# Altium schematic sheet BoostStage.SchDoc
size A
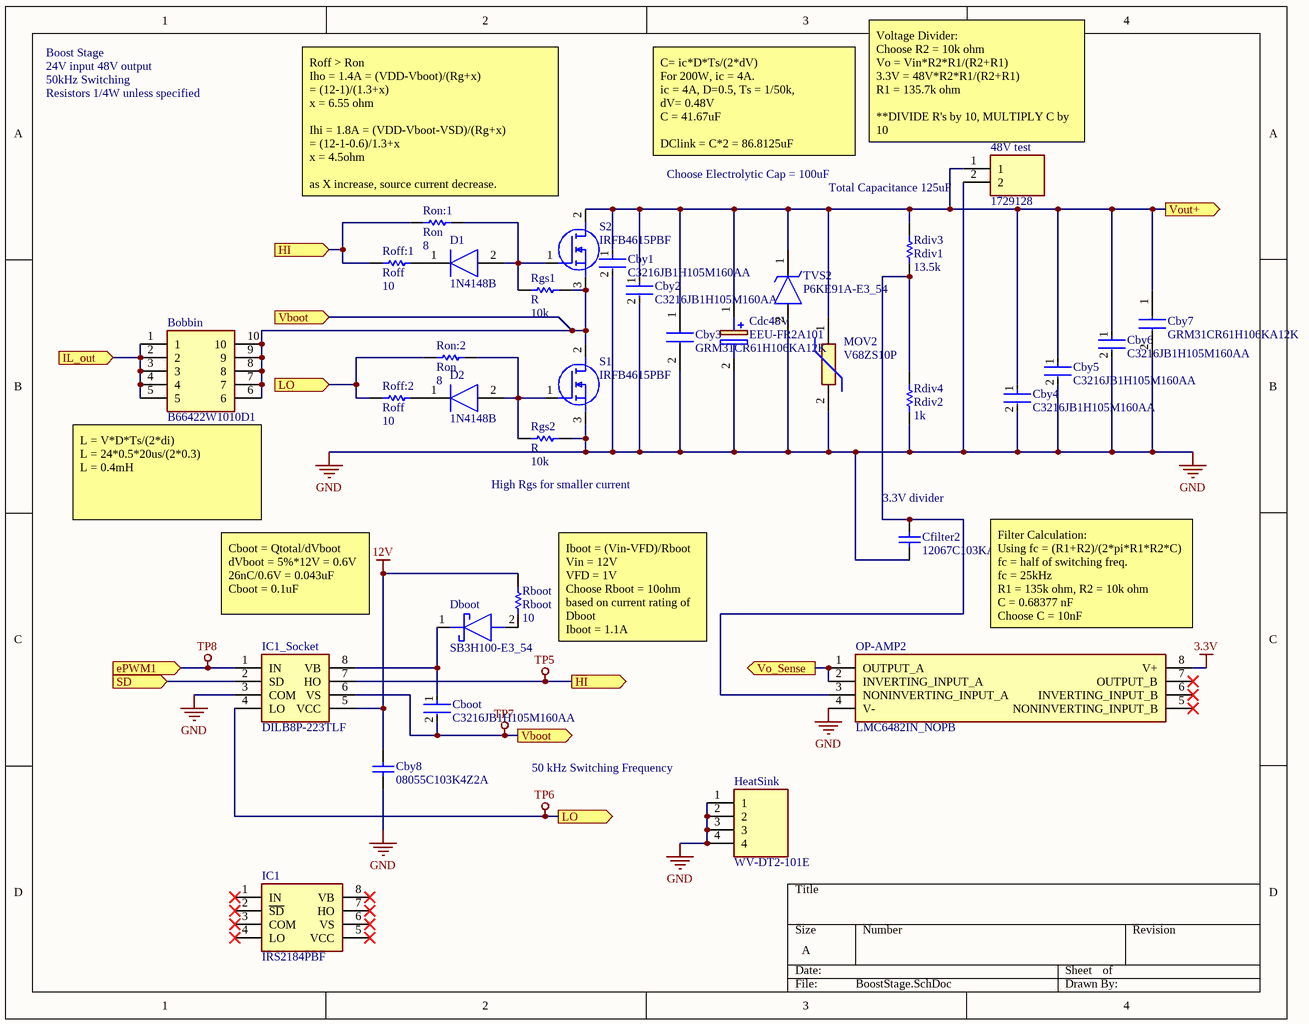
[diagram p0: BoostStage.SchDoc]

## Parts
48V_test  1729128  [HDRV2W110P0X508_1X2_1016X810X1000P]
Bobbin  B66422W1010D1  [B66422W1010D1]
Cboot  C3216JB1H105M160AA  [FP-C3216-160-0_2-IPC_B]
Cby1  C3216JB1H105M160AA  [FP-C3216-160-0_2-IPC_B]
Cby2  C3216JB1H105M160AA  [FP-C3216-160-0_2-IPC_B]
Cby3  GRM31CR61H106KA12K  [CAPC3216X180N]
Cby4  C3216JB1H105M160AA  [FP-C3216-160-0_2-IPC_B]
Cby5  C3216JB1H105M160AA  [FP-C3216-160-0_2-IPC_B]
Cby6  C3216JB1H105M160AA  [FP-C3216-160-0_2-IPC_B]
Cby7  GRM31CR61H106KA12K  [CAPC3216X180N]
Cby8  08055C103K4Z2A  [CAPC2013X94X50NL20T25]
Cdc48V  EEU-FR2A101  [CAPPRD500W65D1000H2200]
Cfilter2  12067C103KAT2A  [CAPC1206(3216)170_N]
D1  1N4148B  [DIOAD990W55L340D162]
D2  1N4148B  [DIOAD990W55L340D162]
Dboot  SB3H100-E3_54  [DIOAD2855W132L835D505]
HeatSink  WV-DT2-101E  [WVDT2101E]
IC1  IRS2184PBF  [DIP762W56P254L988H533Q8N]
IC1_Socket  DILB8P-223TLF  [DIPS762W60P254L1016H525Q8N]
MOV2  V68ZS10P  [V68ZS10P]
OP-AMP2  LMC6482IN_NOPB  [DIP794W53P254L959H508Q8N]
Rboot  Rboot  value 10  [AXIAL-0.3]
Rdiv3  Rdiv1  value 13.5k  [AXIAL-0.3]
Rdiv4  Rdiv2  value 1k  [AXIAL-0.3]
Rgs1  R  value 10k  [AXIAL-0.3]
Rgs2  R  value 10k  [AXIAL-0.3]
Roff:1  Roff  value 10  [AXIAL-0.3]
Roff:2  Roff  value 10  [AXIAL-0.3]
Ron:1  Ron  value 8  [AXIAL-0.3]
Ron:2  Ron  value 8  [AXIAL-0.3]
S1  IRFB4615PBF  [TO254P483X1016X1994-3P]
S2  IRFB4615PBF  [TO254P483X1016X1994-3P]
TVS2  P6KE91A-E3_54  [DIOAD1910W86L670D310]

## Ports
ePWM1 (in), HI (in), HI (out), IL_out (in), LO (in), LO (out), SD (in), Vboot (in), Vboot (out), Vo_Sense (out), Vout+ (out)

## Nets
3.3V: OP-AMP2.8(V+)
12V: Cby8.1 IC1_Socket.5(VCC) Rboot.2
GND: 48V_test.2 Cby1.2 Cby2.2 Cby3.2 Cby4.2 Cby5.2 Cby6.2 Cby7.2 Cby8.2 Cdc48V.2(-) Cfilter2.1 HeatSink.1 HeatSink.2 HeatSink.3 HeatSink.4 IC1_Socket.3(COM) MOV2.2 OP-AMP2.4(V-) Rdiv4.1 Rgs2.2 S1.3(S) TVS2.2(A)
TP5: IC1_Socket.7(HO) Roff:1.1 Ron:1.1 ; port HI
TP6: IC1_Socket.4(LO) Roff:2.1 Ron:2.1 ; port LO
TP7: Bobbin.6 Bobbin.7 Bobbin.8 Bobbin.9 Bobbin.10 Cboot.2 IC1_Socket.6(VS) Rgs1.2 S1.2(D) S2.3(S) ; port Vboot
TP8: IC1_Socket.1(IN) ; port ePWM1
IL_out: Bobbin.1 Bobbin.2 Bobbin.3 Bobbin.4 Bobbin.5 ; port IL_out
SD: IC1_Socket.2(SD) ; port SD
Vo_Sense: OP-AMP2.1(OUTPUT_A) OP-AMP2.2(INVERTING_INPUT_A) ; port Vo_Sense
Vout+: 48V_test.1 Cby1.1 Cby2.1 Cby3.1 Cby4.1 Cby5.1 Cby6.1 Cby7.1 Cdc48V.1(+) MOV2.1 Rdiv3.2 S2.2(D) TVS2.1(K) ; port Vout+
NetCboot_1: Cboot.1 Dboot.1(K) IC1_Socket.8(VB)
NetCfilter2_2: Cfilter2.2 OP-AMP2.3(NONINVERTING_INPUT_A) Rdiv3.1 Rdiv4.2
NetD1_1: D1.1(K) Roff:1.2
NetD1_2: D1.2(A) Rgs1.1 Ron:1.2 S2.1(G)
NetD2_1: D2.1(K) Roff:2.2
NetD2_2: D2.2(A) Rgs2.1 Ron:2.2 S1.1(G)
NetDboot_2: Dboot.2(A) Rboot.1

Not connected (* = marked no-connect by the designer): IC1 1(IN)* 2(~{SD})* 3(COM)* 4(LO)* 5(VCC)* 6(VS)* 7(HO)* 8(VB)*; OP-AMP2 5(NONINVERTING_INPUT_B)* 6(INVERTING_INPUT_B)* 7(OUTPUT_B)*

## Notes on the sheet
- Boost Stage
- 24V input 48V output
- 50kHz Switching
- Resistors 1/4W unless specified
- C= ic*D*Ts/(2*dV)
  For 200W, ic = 4A.
  ic = 4A, D=0.5, Ts = 1/50k,
  dV= 0.48V
  C = 41.67uF
  DClink = C*2 = 86.8125uF
- (near 48V_test) Voltage Divider:
  Choose R2 = 10k ohm
  Vo = Vin*R2*R1/(R2+R1)
  3.3V = 48V*R2*R1/(R2+R1)
  R1 = 135.7k ohm
  **DIVIDE R's by 10, MULTIPLY C by 10
- Roff > Ron
  Iho = 1.4A = (VDD-Vboot)/(Rg+x)
  = (12-1)/(1.3+x)
  x = 6.55 ohm
  Ihi = 1.8A = (VDD-Vboot-VSD)/(Rg+x)
  = (12-1-0.6)/1.3+x
  x = 4.5ohm
  as X increase, source current decrease.
- Choose Electrolytic Cap = 100uF
- (near 48V_test) Total Capacitance 125uF
- (near Rgs2) High Rgs for smaller current
- (near Cfilter2) 3.3V divider
- (near Bobbin) L = V*D*Ts/(2*di)
  L = 24*0.5*20us/(2*0.3)
  L = 0.4mH
- Cboot = Qtotal/dVboot
  dVboot = 5%*12V = 0.6V
  26nC/0.6V = 0.043uF
  Cboot = 0.1uF
- Iboot = (Vin-VFD)/Rboot
  Vin = 12V
  VFD = 1V
  Choose Rboot = 10ohm
  based on current rating of Dboot
  Iboot = 1.1A
- (near OP-AMP2) Filter Calculation:
  Using fc = (R1+R2)/(2*pi*R1*R2*C)
  fc = half of switching freq.
  fc = 25kHz
  R1 = 135k ohm, R2 = 10k ohm
  C = 0.68377 nF
  Choose C = 10nF
- (near HeatSink) 50 kHz Switching Frequency

## Library data of the parts
48V_test = 1729128: Connector; Manufacturer_Name: Phoenix Contact; Datasheet Link: http://docs-emea.rs-online.com/webdocs/1380/0900766b81380189.pdf; Height: 10mm; Manufacturer_Part_Number: 1729128; Mouser Part Number: 651-1729128; Mouser Price/Stock: https://www.mouser.co.uk/ProductDetail/Phoenix-Contact/1729128?qs=GFUSqQMLmmnCBVBY3dts9w%3D%3D; Arrow Part Number: 1729128; Arrow Price/Stock: https://www.arrow.com/en/products/1729128/phoenix-contact
Bobbin = B66422W1010D1: Bobbin; Manufacturer_Name: EPCOS; Datasheet Link: https://componentsearchengine.com/Datasheets/1/B66422W1010D1.pdf; Height: 12mm; Mouser2 Part Number: 871-B66422W1010D1; Mouser2 Price/Stock: https://www.mouser.com/Search/Refine.aspx?Keyword=871-B66422W1010D1; Manufacturer_Part_Number: B66422W1010D1
Cboot Cby1 Cby2 Cby4-Cby6 = CMP-08246-003576-1: Multilayer Ceramic Capacitors 1uF ±20% 50V JB SMD 1206; Capacitance: 1uF; Tolerance: 20%; Case/Package: 1206; Height: 1.6mm; Series: C; Termination: SMD/SMT; Case Code (Imperial): 1206; Voltage Rating: 50V; Max Operating Temperature: 85°C; Lead Free: Lead Free; Length: 0.126inch; Min Operating Temperature: -25°C; Case Code (Metric): 3216; Thickness: 0.069inch; Package Quantity: 2000; Width: 1.6mm; Voltage Rating (DC): 50V; Resistor Type: Ceramic; Mount: Surface Mount; Dielectric Material: Ceramic; Packaging: Tape and Reel
Cby3 Cby7 = GRM31CR61H106KA12K: Capacitor Ceramic 10uF; Manufacturer_Name: Murata Electronics; Datasheet Link: http://www.murata.com/~/media/webrenewal/support/library/catalog/products/capacitor/mlcc/c02e.pdf; Height: 1.8mm; Manufacturer_Part_Number: GRM31CR61H106KA12K; Mouser Part Number: 81-GRM31CR61H106KA2K; Mouser Price/Stock: https://www.mouser.co.uk/ProductDetail/Murata-Electronics/GRM31CR61H106KA12K?qs=hNud%2FORuBR2LdVXo%252BGUPLw%3D%3D
Cby8 = CMP-2007-04362-1: Manufacturer: AVX Interconnect / Elco; Part Number: 08055C103K4Z2A
Cdc48V = EEU-FR2A101: 100uF Capacitor Polarised; Manufacturer_Name: Panasonic; Datasheet Link: https://industrial.panasonic.com/cdbs/www-data/pdf/RDF0000/ABA0000C1259.pdf; Height: 22mm; Manufacturer_Part_Number: EEU-FR2A101; Mouser Part Number: 667-EEU-FR2A101; Mouser Price/Stock: https://www.mouser.co.uk/ProductDetail/Panasonic/EEU-FR2A101?qs=n7vHx8wJlDHCZg6DRLuY%252Bw%3D%3D
Cfilter2 = CMP-1037-03540-1: CAP 10nF 500V ±10% 1206 (3216 Metric) Thickness 1.7mm SMD; Tolerance: Â±10%; Case-Metric: 3216; Case-EIA: 1206; Rated Voltage: 500 V; Value: 10nF; Max Thickness: 1.7 mm; Technology: SMT
D1 D2 = 1N4148B: Diode; Manufacturer_Name: Vishay; Datasheet Link: https://www.vishay.com/docs/81857/1n4148.pdf; Manufacturer_Part_Number: 1N4148B
Dboot = SB3H100-E3_54: Schottky Diode; Manufacturer_Name: Vishay; Manufacturer_Part_Number: SB3H100-E3/54; Datasheet Link: http://www.vishay.com/docs/88720/sb3h90.pdf; Mouser Part Number: 625-SB3H100-E3; Mouser Price/Stock: https://www.mouser.com/Search/Refine.aspx?Keyword=625-SB3H100-E3
HeatSink = WV-DT2-101E: Hardware; Manufacturer_Name: Ohmite; Datasheet Link: https://componentsearchengine.com/Datasheets/1/WV-DT2-101E.pdf; Height: 32.3mm; Manufacturer_Part_Number: WV-DT2-101E; Mouser Part Number: 588-WV-DT2-101E; Mouser Price/Stock: https://www.mouser.com/Search/Refine.aspx?Keyword=588-WV-DT2-101E
IC1 = IRS2184PBF: Integrated Circuit; Manufacturer_Name: Infineon; Datasheet Link: http://uk.rs-online.com/web/p/products/0456214; Height: 5.33mm; Manufacturer_Part_Number: IRS2184PBF; Mouser Part Number: 942-IRS2184PBF; Mouser Price/Stock: https://www.mouser.co.uk/ProductDetail/Infineon-Technologies/IRS2184PBF?qs=9%252BKlkBgLFf3%2F4k8XP8%252BWIw%3D%3D; Arrow Part Number: IRS2184PBF; Arrow Price/Stock: https://www.arrow.com/en/products/irs2184pbf/infineon-technologies-ag
IC1_Socket = DILB8P-223TLF: Connector; Manufacturer_Name: Amphenol; Datasheet Link: https://componentsearchengine.com/Datasheets/1/DILB8P-223TLF.pdf; Height: 5.25mm; Mouser2 Part Number: 649-DILB8P223TLF; Mouser2 Price/Stock: https://www.mouser.com/Search/Refine.aspx?Keyword=649-DILB8P223TLF; Manufacturer_Part_Number: DILB8P-223TLF
MOV2 = V68ZS10P: Varistor; Manufacturer_Name: LITTELFUSE; Datasheet Link: http://www.littelfuse.com/~/media/electronics/datasheets/varistors/littelfuse_varistor_za_datasheet.pdf.pdf; Height: 20mm; Manufacturer_Part_Number: V68ZS10P; Mouser Part Number: 576-V68ZS10P; Mouser Price/Stock: https://www.mouser.co.uk/ProductDetail/Littelfuse/V68ZS10P?qs=1%2FWRN91BpNvIRlTsONWDiQ%3D%3D
OP-AMP2 = LMC6482IN_NOPB: Integrated Circuit; Manufacturer_Name: Texas Instruments; Manufacturer_Part_Number: LMC6482IN/NOPB; Datasheet Link: http://www.ti.com/lit/gpn/lmc6482; Height: 5.08mm; Mouser Part Number: 926-LMC6482IN/NOPB; Mouser Price/Stock: https://www.mouser.co.uk/ProductDetail/Texas-Instruments/LMC6482IN-NOPB?qs=QbsRYf82W3EByDDrj8Vijg%3D%3D; Arrow Part Number: LMC6482IN/NOPB; Arrow Price/Stock: https://www.arrow.com/en/products/lmc6482innopb/texas-instruments
Rboot = Res1: 1/2W 10ohm Resistor; Published: 8-Jun-2000; LatestRevisionDate: 17-Jul-2002; LatestRevisionNote: Re-released for DXP Platform.; PackageReference: AXIAL-0.3; Publisher: Altium Limited; PackageDescription: Axial Device, Thru-Hole; 2 Leads; 0.3 in Pin Spacing
Rdiv3 = Res1: 1/4W 135.455k ohm Resistor; Published: 8-Jun-2000; LatestRevisionDate: 17-Jul-2002; LatestRevisionNote: Re-released for DXP Platform.; PackageReference: AXIAL-0.3; Publisher: Altium Limited; PackageDescription: Axial Device, Thru-Hole; 2 Leads; 0.3 in Pin Spacing
Rdiv4 Rgs1 Rgs2 = Res1: 1/4W 10k ohm Resistor; Published: 8-Jun-2000; LatestRevisionDate: 17-Jul-2002; LatestRevisionNote: Re-released for DXP Platform.; PackageReference: AXIAL-0.3; Publisher: Altium Limited; PackageDescription: Axial Device, Thru-Hole; 2 Leads; 0.3 in Pin Spacing
Roff:1 Roff:2 = Res1: 1/4W 10ohm Resistor; Published: 8-Jun-2000; LatestRevisionDate: 17-Jul-2002; LatestRevisionNote: Re-released for DXP Platform.; PackageReference: AXIAL-0.3; Publisher: Altium Limited; PackageDescription: Axial Device, Thru-Hole; 2 Leads; 0.3 in Pin Spacing
Ron:1 Ron:2 = Res1: 1/4W 8ohm Resistor; Published: 8-Jun-2000; LatestRevisionDate: 17-Jul-2002; LatestRevisionNote: Re-released for DXP Platform.; PackageReference: AXIAL-0.3; Publisher: Altium Limited; PackageDescription: Axial Device, Thru-Hole; 2 Leads; 0.3 in Pin Spacing
S1 S2 = IRFB4615PBF: MOSFET (N-Channel); Manufacturer_Name: Infineon; Datasheet Link: https://static6.arrow.com/aropdfconversion/fc085eb00e813bec65c58b34c53aeea1d8b02a1f/irfb4615pbf.pdf; Height: 4.83mm; Manufacturer_Part_Number: IRFB4615PBF; Mouser Part Number: 942-IRFB4615PBF; Mouser Price/Stock: https://www.mouser.co.uk/ProductDetail/Infineon-Technologies/IRFB4615PBF?qs=9%252BKlkBgLFf20BbweusQYXA%3D%3D; Arrow Part Number: IRFB4615PBF; Arrow Price/Stock: https://www.arrow.com/en/products/irfb4615pbf/infineon-technologies-ag
TVS2 = P6KE91A-E3_54: TVS Diode (Uni-directional); Manufacturer_Name: Vishay; Manufacturer_Part_Number: P6KE91A-E3/54; Datasheet Link: https://www.mouser.com/datasheet/2/427/p6ke-1767850.pdf